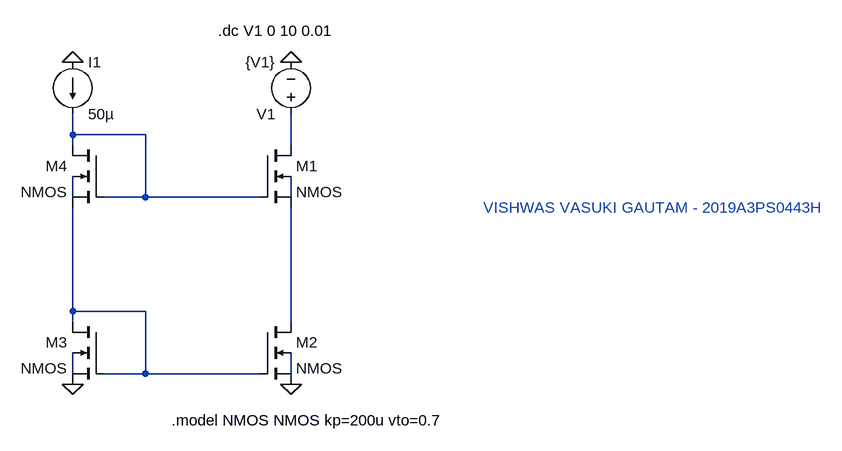
[diagram p0: schematic Current_Mirror_NMOS.asc]
Current_Mirror_NMOS.asc, the LTspice schematic file:
Version 4
SHEET 1 880 680
WIRE -448 -160 -448 -192
WIRE -336 -160 -448 -160
WIRE -448 -144 -448 -160
WIRE -112 -144 -112 -192
WIRE -448 -64 -448 -96
WIRE -336 -64 -336 -160
WIRE -336 -64 -400 -64
WIRE -160 -64 -336 -64
WIRE -112 -64 -112 -96
WIRE -448 112 -448 -48
WIRE -336 112 -448 112
WIRE -448 128 -448 112
WIRE -112 128 -112 -48
WIRE -448 208 -448 176
WIRE -336 208 -336 112
WIRE -336 208 -400 208
WIRE -160 208 -336 208
WIRE -112 208 -112 176
FLAG -448 -272 0
FLAG -448 224 0
FLAG -112 224 0
FLAG -112 -272 0
SYMBOL nmos4 -160 -144 R0
SYMATTR InstName M1
SYMATTR Value2 l=15u w=75u
SYMBOL nmos4 -160 128 R0
SYMATTR InstName M2
SYMATTR Value2 l=15u w=75u
SYMBOL voltage -112 -176 R180
WINDOW 123 0 0 Left 2
WINDOW 39 0 0 Left 2
SYMATTR InstName V1
SYMATTR Value {V1}
SYMBOL current -448 -272 R0
WINDOW 123 0 0 Left 2
WINDOW 39 0 0 Left 2
SYMATTR InstName I1
SYMATTR Value 50µ
SYMBOL nmos4 -400 128 M0
SYMATTR InstName M3
SYMATTR Value2 l=15u w=75u
SYMBOL nmos4 -400 -144 M0
SYMATTR InstName M4
TEXT -224 -320 Left 2 !.dc V1 0 10 0.01
TEXT -296 280 Left 2 !.model NMOS NMOS kp=200u vto=0.7
TEXT 184 -48 Left 2 ;VISHWAS VASUKI GAUTAM - 2019A3PS0443H

The netlist it stands for:
* Current_Mirror_NMOS.asc
M1 N002 N001 N006 N004 NMOS l=15u w=75u
M2 N006 N005 0 N008 NMOS l=15u w=75u
V1 N002 0 {V1}
I1 0 N001 50µ
M3 N005 N005 0 N007 NMOS l=15u w=75u
M4 N001 N001 N005 N003 NMOS
.model NMOS NMOS
.model PMOS PMOS
.lib standard.mos
.dc V1 0 10 0.01
.model NMOS NMOS kp=200u vto=0.7
* VISHWAS VASUKI GAUTAM - 2019A3PS0443H
.backanno
.end